# EAGLE schematic StomDemoboard (EAGLE 7.7.0)
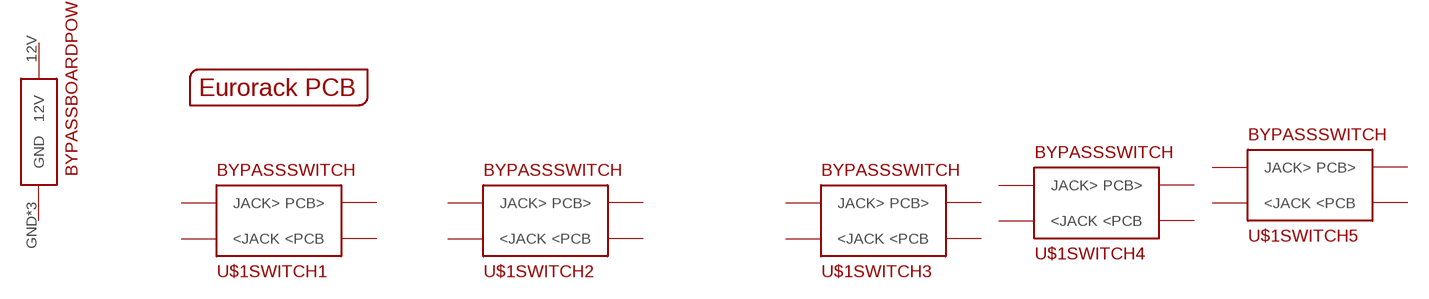
[diagram p0: schematic, sheet 1]

## Parts
PCB1  EURORACK_PCB36HP_TALLBOARD  [EURORACK36HP_TALLERBOARD]
U$1  5STOMPBOARD  [BYPASSBOARD]
Unconnected: U$1.12V U$1.GND U$1.GND2(GND) U$1.GND3(GND) U$1.P$1(SWITCH1:<JACK) U$1.P$2(SWITCH1:<PCB) U$1.P$3(SWITCH1:JACK>) U$1.P$4(SWITCH1:PCB>) U$1.P$5(SWITCH2:<JACK) U$1.P$6(SWITCH2:<PCB) U$1.P$7(SWITCH2:JACK>) U$1.P$8(SWITCH2:PCB>) U$1.P$9(SWITCH3:<JACK) U$1.P$10(SWITCH3:<PCB) U$1.P$11(SWITCH3:JACK>) U$1.P$12(SWITCH3:PCB>) U$1.P$13(SWITCH4:<JACK) U$1.P$14(SWITCH4:<PCB) U$1.P$15(SWITCH4:JACK>) U$1.P$16(SWITCH4:PCB>) U$1.P$17(SWITCH5:<JACK) U$1.P$18(SWITCH5:<PCB) U$1.P$19(SWITCH5:JACK>) U$1.P$20(SWITCH5:PCB>)

## Library data of the parts
PCB1 = EurorackModularParts:EURORACK_PCB
U$1 = EurorackModularParts:5STOMPBOARD